# EAGLE schematic usbDirectController2 (EAGLE 9.4.0)

## Sheet 1 of 2
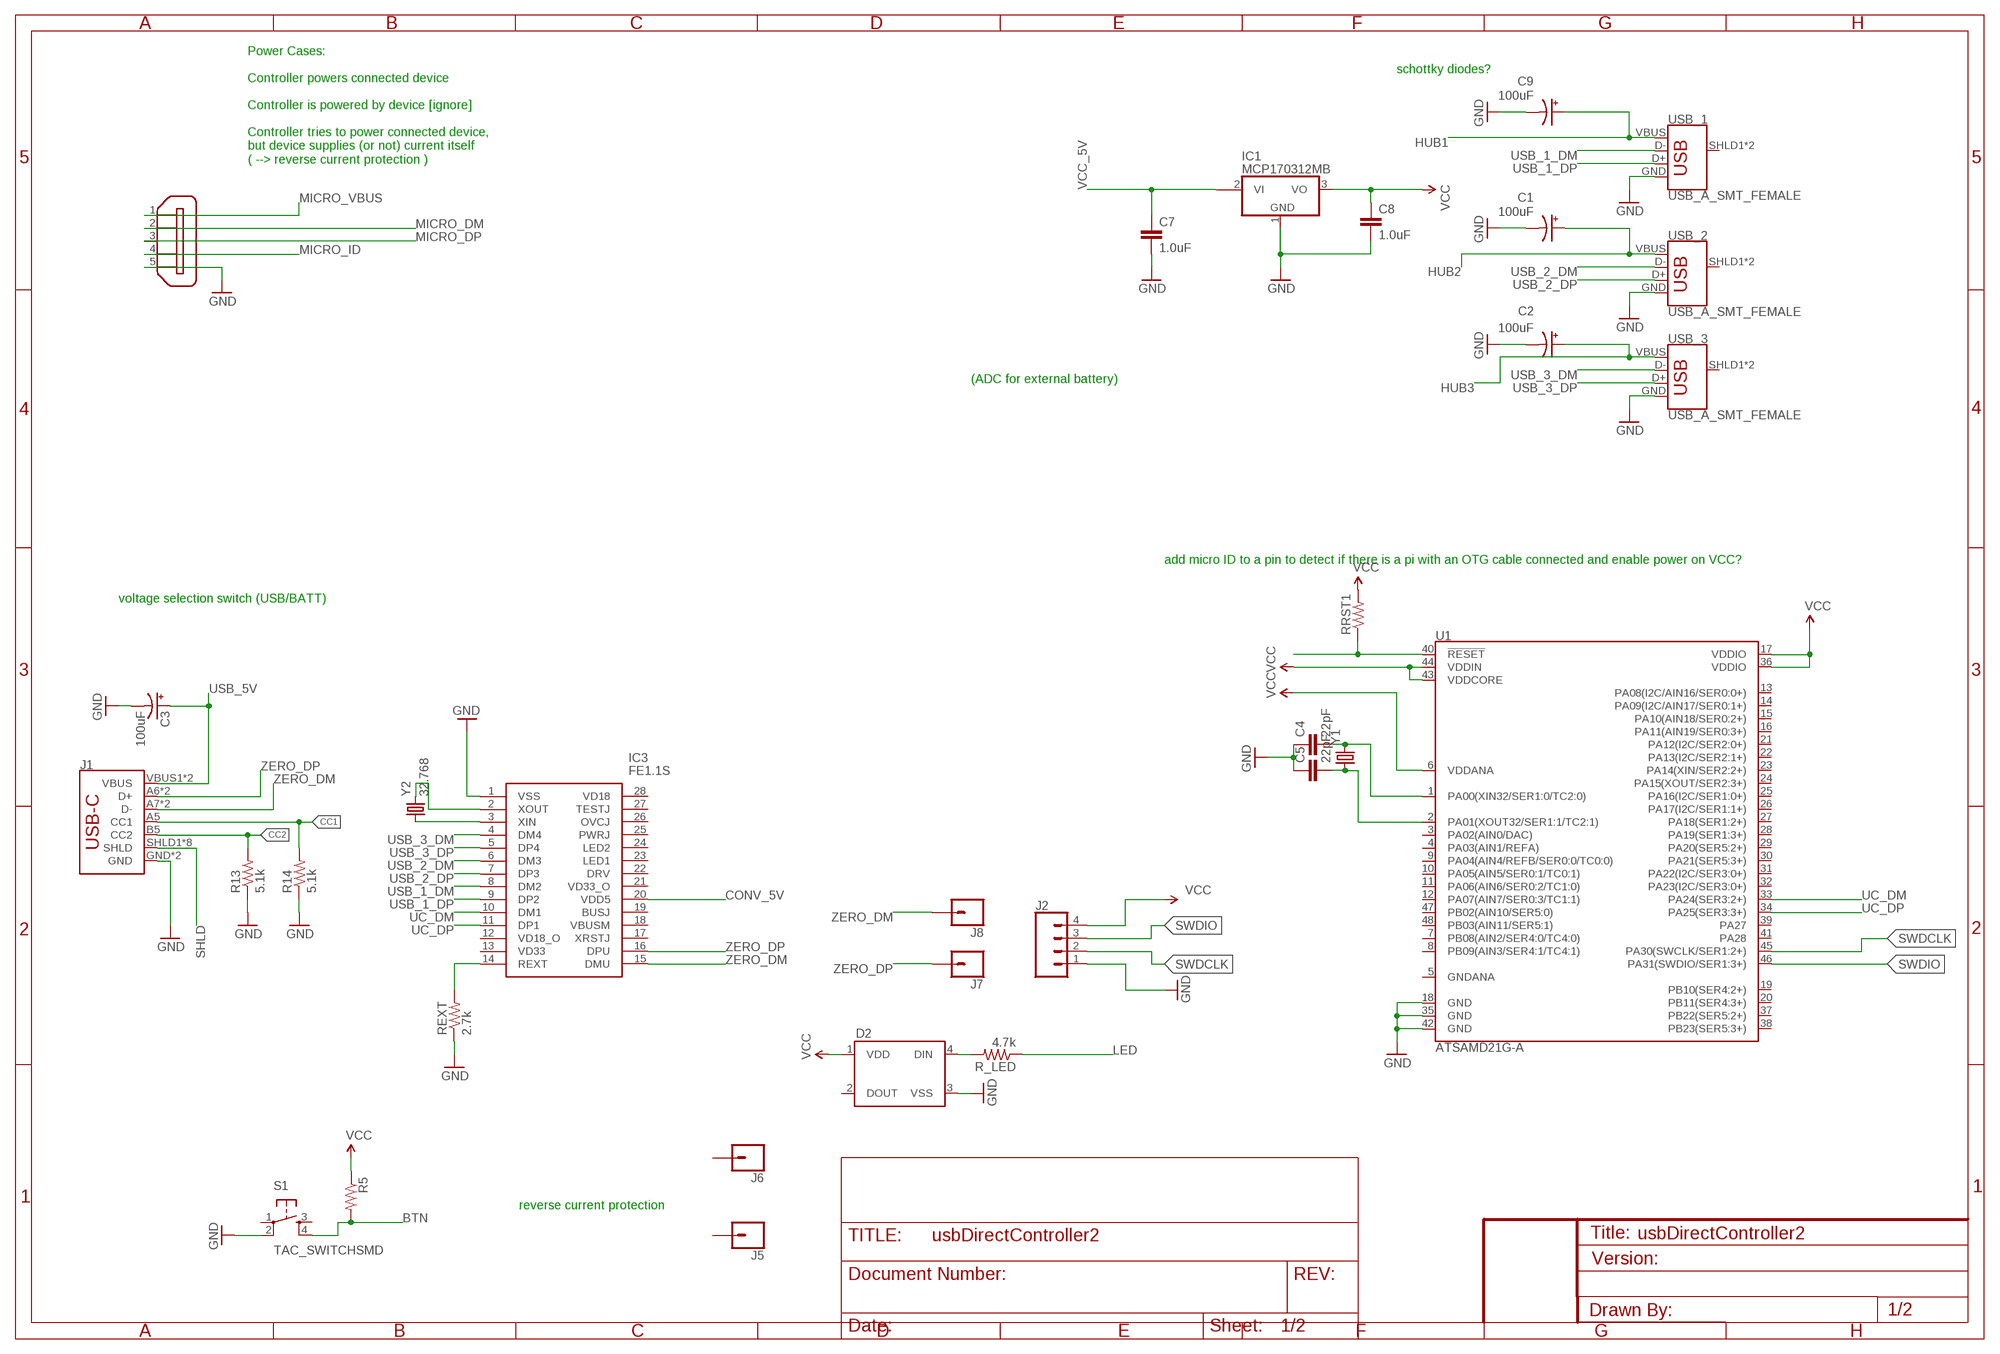
[diagram p0: schematic, sheet 1]

### Parts
C1  100uF  100UF-POLAR-25V-20%(ELEC)  [PANASONIC_D]
C2  100uF  100UF-POLAR-25V-20%(ELEC)  [PANASONIC_D]
C3  100uF  100UF-POLAR-25V-20%(ELEC)  [PANASONIC_D]
C4  22pF  CAP1206  [1206]
C5  22pF  CAP1206  [1206]
C7  1.0uF  1.0UF-1206-50V-10%  [1206]
C8  1.0uF  1.0UF-1206-50V-10%  [1206]
C9  100uF  100UF-POLAR-25V-20%(ELEC)  [PANASONIC_D]
D2  WS2812B  [WS2812B]
IC1  MCP170312MB  [SOT89]
IC3  FE1.1S  [SOP64P600X175-28N]
J1  USB_C16PIN  [USB-C-16P]
J2  CONN_04  [1X04]
J5  CONN_01POGOPIN_HOLE_0.58  [1X01_POGOPIN_HOLE_0.58_DIA]
J6  CONN_01POGOPIN_HOLE_0.58  [1X01_POGOPIN_HOLE_0.58_DIA]
J7  CONN_01POGOPIN_HOLE_0.58  [1X01_POGOPIN_HOLE_0.58_DIA]
J8  CONN_01POGOPIN_HOLE_0.58  [1X01_POGOPIN_HOLE_0.58_DIA]
R5  RESISTOR1206  [1206]
R13  5.1k  RESISTOR0805-RES  [0805]
R14  5.1k  RESISTOR0805-RES  [0805]
R_LED  4.7k  RESISTOR1206  [1206]
REXT  2.7k  RESISTOR1206  [1206]
RRST1  RESISTOR1206  [1206]
S1  TAC_SWITCHSMD  TAC_SWITCHPTH  [TACTILE-PTH]
U1  ATSAMD21G-A  [TQFP-48]
USB_1  USB_A_SMT_FEMALE  [USB-A-S-SILK-FEMALE]
USB_2  USB_A_SMT_FEMALE  [USB-A-S-SILK-FEMALE]
USB_3  USB_A_SMT_FEMALE  [USB-A-S-SILK-FEMALE]
X2  ZX62D-B-5PA8  [ZX62D-B-5PA8]
Y1  CRYSTALCRYSTAL-SMD-5X3-16MHZ  [CRYSTAL-SMD-5X3]
Y2  32.768  CRYSTALCRYSTAL-SMD-5X3-16MHZ  [CRYSTAL-SMD-5X3]

### Nets
BTN: R5.2 S1.4
CC1: J1.A5(CC1) R14.2
CC2: J1.B5(CC2) R13.2
CONV_5V [power]: IC3.20(VDD5)
GND: C1.- C2.- C3.- C4.1 C5.1 C7.2 C8.2 C9.- D2.3(VSS) IC1.1(GND) IC3.1(VSS) J1.GND J1.GND2(GND) J2.1 R13.1 R14.1 REXT.1 S1.2 U1.18(GND) U1.35(GND) U1.42(GND) USB_1.GND USB_2.GND USB_3.GND X2.5 ; also sheet 2
HUB1: C9.+ USB_1.VBUS
HUB2: C1.+ USB_2.VBUS
HUB3: C2.+ USB_3.VBUS
LED: R_LED.1
MICRO_DM: X2.2
MICRO_DP: X2.3
MICRO_ID: X2.4
MICRO_VBUS: X2.1
N$7: D2.4(DIN) R_LED.2
N$8: C4.2 U1.1(PA00(XIN32/SER1:0/TC2:0)) Y1.3
N$21: RRST1.1 U1.40(!RESET!)
N$23: IC3.3(XIN) Y2.1
N$24: IC3.2(XOUT) Y2.3
N$31: IC3.14(REXT) REXT.2
N$32: C5.2 U1.2(PA01(XOUT32/SER1:1/TC2:1)) Y1.1
SHLD: J1.SHLD1(SHLD) J1.SHLD2(SHLD) J1.SHLD3(SHLD) J1.SHLD4(SHLD) J1.SHLD5(SHLD) J1.SHLD6(SHLD) J1.SHLD7(SHLD) J1.SHLD8(SHLD)
SWDCLK: J2.2 U1.45(PA30(SWCLK/SER1:2+))
SWDIO: J2.3 U1.46(PA31(SWDIO/SER1:3+))
UC_DM: IC3.10(DM1) U1.33(PA24(SER3:2+))
UC_DP: IC3.11(DP1) U1.34(PA25(SER3:3+))
USB_1_DM: IC3.8(DM2) USB_1.D-
USB_1_DP: IC3.9(DP2) USB_1.D+
USB_2_DM: IC3.6(DM3) USB_2.D-
USB_2_DP: IC3.7(DP3) USB_2.D+
USB_3_DM: IC3.4(DM4) USB_3.D-
USB_3_DP: IC3.5(DP4) USB_3.D+
USB_5V: C3.+ J1.VBUS1(VBUS) J1.VBUS2(VBUS)
VCC [power]: C8.1 D2.1(VDD) IC1.3(VO) J2.4 R5.1 RRST1.2 U1.6(VDDANA) U1.17(VDDIO) U1.36(VDDIO) U1.43(VDDCORE) U1.44(VDDIN)
VCC_5V [power]: C7.1 IC1.2@1(VI1) ; also sheet 2
ZERO_DM: IC3.15(DMU) J1.A7(D-) J1.B7(D-) J8.1
ZERO_DP: IC3.16(DPU) J1.A6(D+) J1.B6(D+) J7.1
Unconnected: D2.2(DOUT) IC1.2(VI) IC3.12(VD18_O) IC3.13(VD33) IC3.17(XRSTJ) IC3.18(VBUSM) IC3.19(BUSJ) IC3.21(VD33_O) IC3.22(DRV) IC3.23(LED1) IC3.24(LED2) IC3.25(PWRJ) IC3.26(OVCJ) IC3.27(TESTJ) IC3.28(VD18) J5.1 J6.1 S1.1 S1.3 U1.3(PA02(AIN0/DAC)) U1.4(PA03(AIN1/REFA)) U1.5(GNDANA) U1.7(PB08(AIN2/SER4:0/TC4:0)) U1.8(PB09(AIN3/SER4:1/TC4:1)) U1.9(PA04(AIN4/REFB/SER0:0/TC0:0)) U1.10(PA05(AIN5/SER0:1/TC0:1)) U1.11(PA06(AIN6/SER0:2/TC1:0)) U1.12(PA07(AIN7/SER0:3/TC1:1)) U1.13(PA08(I2C/AIN16/SER0:0+)) U1.14(PA09(I2C/AIN17/SER0:1+)) U1.15(PA10(AIN18/SER0:2+)) U1.16(PA11(AIN19/SER0:3+)) U1.19(PB10(SER4:2+)) U1.20(PB11(SER4:3+)) U1.21(PA12(I2C/SER2:0+)) U1.22(PA13(I2C/SER2:1+)) U1.23(PA14(XIN/SER2:2+)) U1.24(PA15(XOUT/SER2:3+)) U1.25(PA16(I2C/SER1:0+)) U1.26(PA17(I2C/SER1:1+)) U1.27(PA18(SER1:2+)) U1.28(PA19(SER1:3+)) U1.29(PA20(SER5:2+)) U1.30(PA21(SER5:3+)) U1.31(PA22(I2C/SER3:0+)) U1.32(PA23(I2C/SER3:0+)) U1.37(PB22(SER5:2+)) U1.38(PB23(SER5:3+)) U1.39(PA27) U1.41(PA28) U1.47(PB02(AIN10/SER5:0)) U1.48(PB03(AIN11/SER5:1)) USB_1.SHLD1(SHIELD) USB_1.SHLD2(SHIELD) USB_2.SHLD1(SHIELD) USB_2.SHLD2(SHIELD) USB_3.SHLD1(SHIELD) USB_3.SHLD2(SHIELD) X2.S1 X2.S2 X2.S3 X2.S4

### Notes on the sheet
- schottky diodes?
- Power Cases:
  
  Controller powers connected device
  
  Controller is powered by device [ignore]
  
  Controller tries to power connected device, 
  but device supplies (or not) current itself
  ( --> reverse current protection )
- (ADC for external battery)
- add micro ID to a pin to detect if there is a pi with an OTG cable connected and enable power on VCC?
- voltage selection switch (USB/BATT)
- reverse current protection

## Sheet 2 of 2
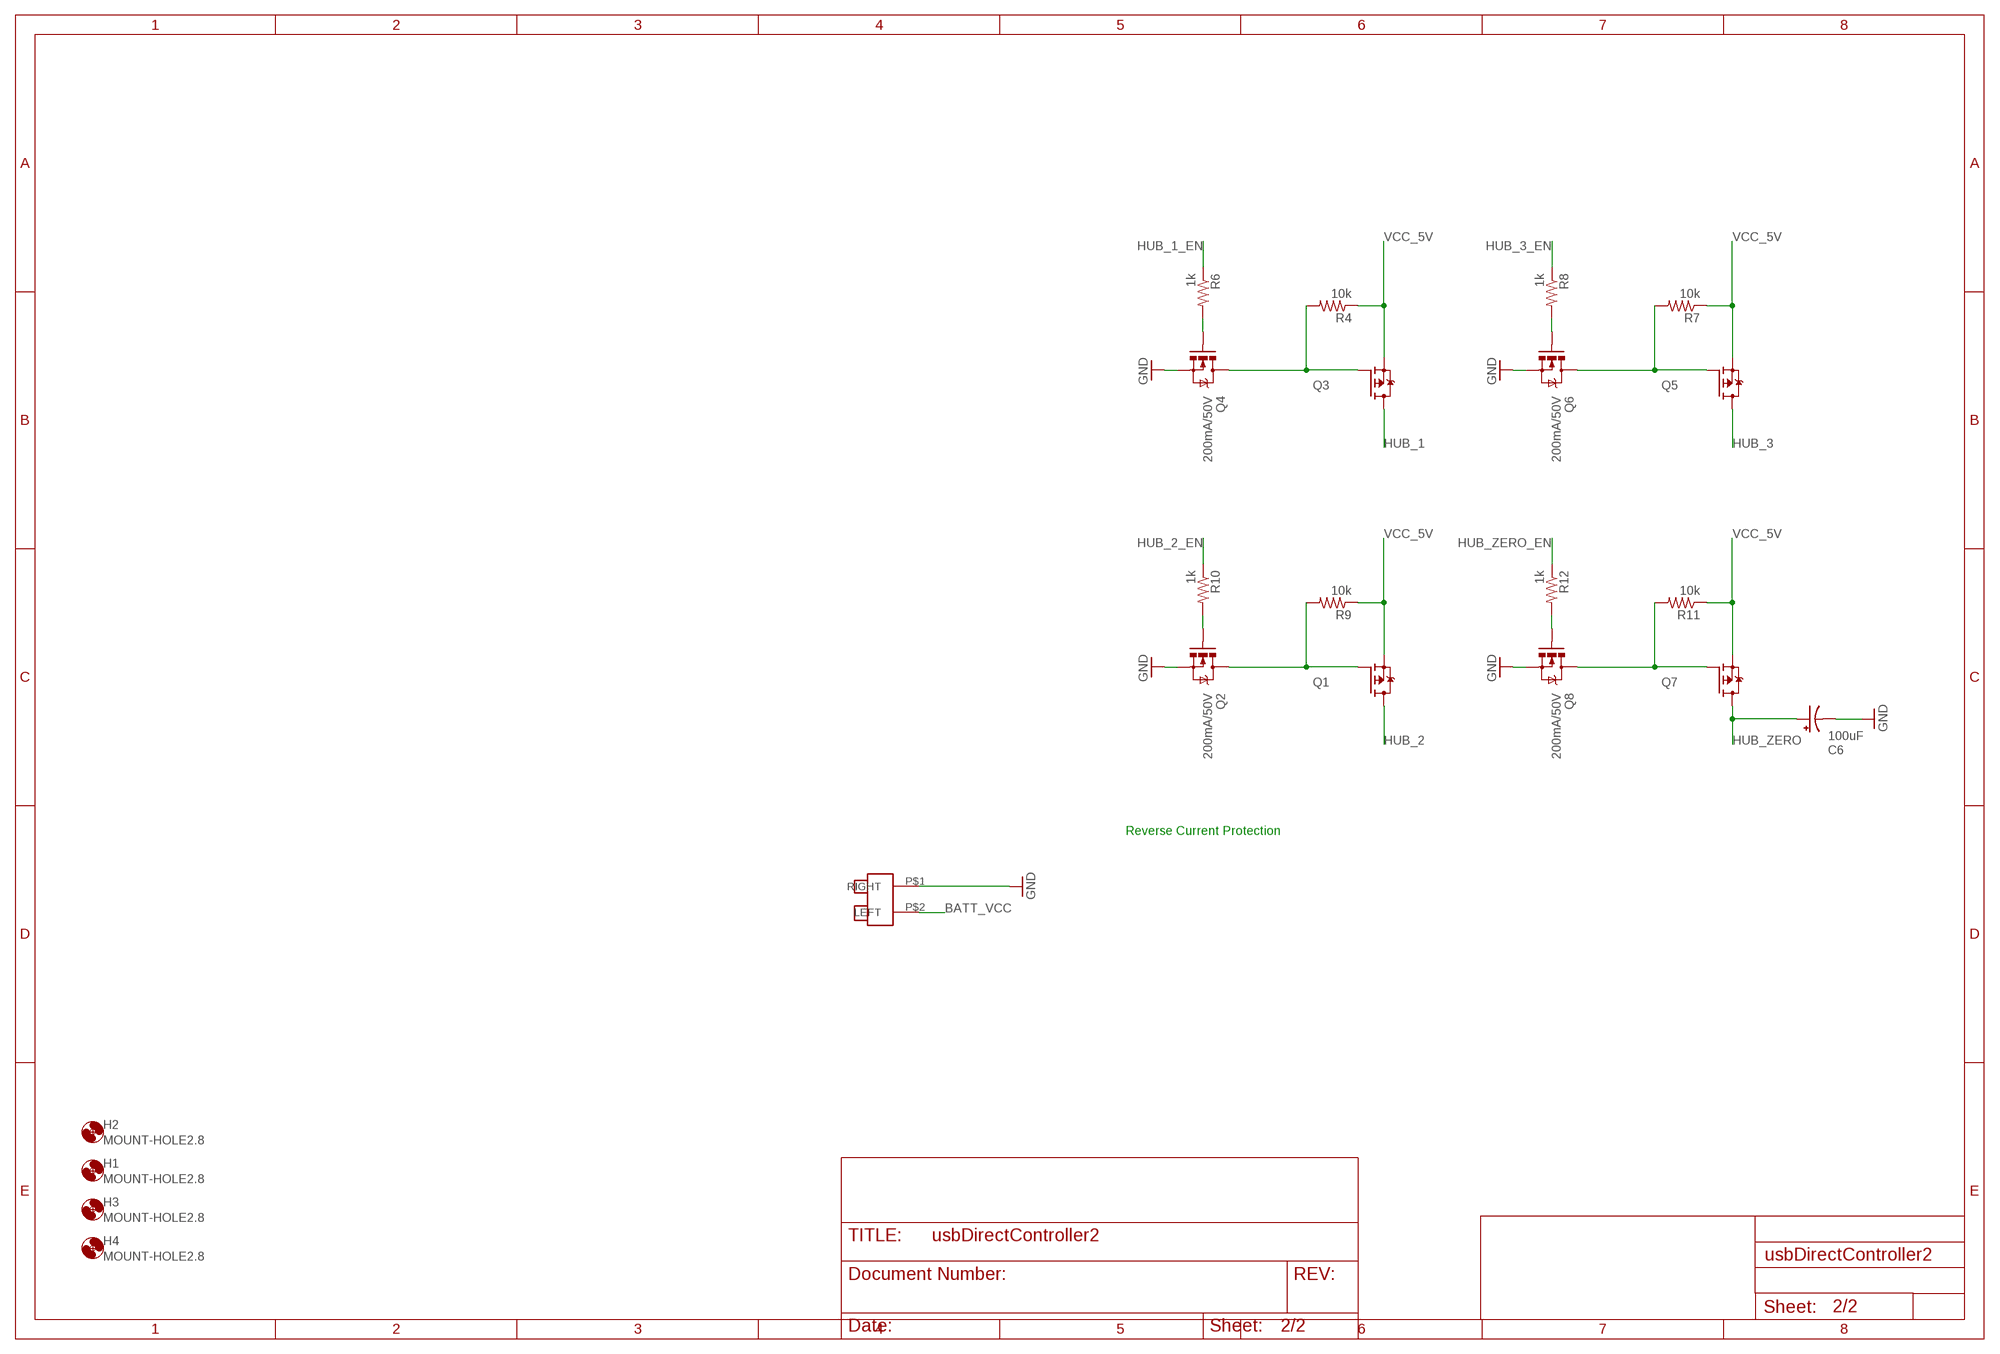
[diagram p1: schematic, sheet 2]

### Parts
C6  100uF  100UF-POLAR-25V-20%(ELEC)  [PANASONIC_D]
H1  MOUNT-HOLE2.8  [2,8]
H2  MOUNT-HOLE2.8  [2,8]
H3  MOUNT-HOLE2.8  [2,8]
H4  MOUNT-HOLE2.8  [2,8]
Q1  FDD4141TO252  [TO252]
Q2  200mA/50V  MOSFET-NCHANNELBSS138  [SOT23-3]
Q3  FDD4141TO252  [TO252]
Q4  200mA/50V  MOSFET-NCHANNELBSS138  [SOT23-3]
Q5  FDD4141TO252  [TO252]
Q6  200mA/50V  MOSFET-NCHANNELBSS138  [SOT23-3]
Q7  FDD4141TO252  [TO252]
Q8  200mA/50V  MOSFET-NCHANNELBSS138  [SOT23-3]
R4  10k  RESISTOR1206  [1206]
R6  1k  RESISTOR1206  [1206]
R7  10k  RESISTOR1206  [1206]
R8  1k  RESISTOR1206  [1206]
R9  10k  RESISTOR1206  [1206]
R10  1k  RESISTOR1206  [1206]
R11  10k  RESISTOR1206  [1206]
R12  1k  RESISTOR1206  [1206]
U$4  NANOFIT2  [NANOFIT2]

### Nets
BATT_VCC [hub_power]: U$4.P$2(LEFT)
GND: C6.- Q2.2(S) Q4.2(S) Q6.2(S) Q8.2(S) U$4.P$1(RIGHT) ; also sheet 1
HUB_1 [power]: Q3.3(D)
HUB_1_EN: R6.1
HUB_2 [hub_power]: Q1.3(D)
HUB_2_EN: R10.1
HUB_3 [power]: Q5.3(D)
HUB_3_EN: R8.1
HUB_ZERO [hub_power]: C6.+ Q7.3(D)
HUB_ZERO_EN: R12.1
N$1: Q1.1(G) Q2.3(D) R9.2
N$2: Q4.1(G) R6.2
N$3: Q3.1(G) Q4.3(D) R4.2
N$6: Q2.1(G) R10.2
N$12: Q5.1(G) Q6.3(D) R7.2
N$13: Q6.1(G) R8.2
N$15: Q7.1(G) Q8.3(D) R11.2
N$19: Q8.1(G) R12.2
VCC_5V [power]: Q1.2(S) Q3.2(S) Q5.2(S) Q7.2(S) R4.1 R7.1 R9.1 R11.1 ; also sheet 1

### Notes on the sheet
- Reverse Current Protection

## Library data of the parts
C1-C3 C6 C9 = SparkFun-Capacitors:100UF-POLAR: 100µF polarized capacitors A capacitor is a passive two-terminal electrical component used to store electrical energy temporarily in an electric field.; PROD_ID: CAP-12547
C4 C5 = SparkFun-Passives:CAP: Capacitor Standard 0603 ceramic capacitor, and 0.1" leaded capacitor.
C7 C8 = SparkFun-Capacitors:1.0UF: 1µF ceramic capacitors A capacitor is a passive two-terminal electrical component used to store electrical energy temporarily in an electric field.; PROD_ID: CAP-09822
D2 = SparkFun-LED:WS2812B: WS2812B - Intelligent control LED integrated light source Technical Specifications: Power Supply Voltage (VDD): 3.5 to 5.3 V Input Voltage (VI): -0.5 to VDD+0.5 V Operating Junction Temperature (Topt): -25°C to +80°C Storage Temperature Range (Tstg): -55°C to +150°C; PROD_ID: DIO-12503
H1-H4 = holes:MOUNT-HOLE: MOUNTING HOLE with drill center marker
IC1 = linear:MCP1703*: 250 mA, 16V, Low Quiescent Current LDO Regulator Source: http://ww1.microchip.com/downloads/en/DeviceDoc/22049b.pdf
IC3 = FE1.1S:FE1.1S: USB 2.0 HIGH SPEED 4-PORT HUB CONTROLLER Source: Datasheet <https://cdn-shop.adafruit.com/product-files/2991/FE1.1s Data Sheet (Rev. 1.0).pdf>; DESCRIPTION: USB 2.0 HIGH SPEED 4-PORT HUB CONTROLLER; HEIGHT: 1.75mm; MANUFACTURER_NAME: JFD IC; MANUFACTURER_PART_NUMBER: FE1.1S
J1 = SparkFun-Connectors:USB_C: USB Type C 16Pin Connector Super Speed pins not available on the 16-pin purely SMD connector so this part is best for USB 2.0 implementations. D1 and D2 are tied together enabling D+/- no matter which way the cable is plugged into the connector. The two channel configuration pins (CC1/2) are exposed. These are normally connected to ground via 5.1k resistors but can be reconfigured for high current/high power applications.; PROD_ID: CONN-14122
J2 = SparkFun-Connectors:CONN_04: Multi connection point. Often used as Generic Header-pin footprint for 0.1 inch spaced/style header connections On any of the 0.1 inch spaced packages, you can populate with these: Break Away Headers - Straight <https://www.sparkfun.com/products/116> (PRT-00116) Break Away Male Headers - Right Angle <https://www.sparkfun.com/products/553> (PRT-00553) Female Headers <https://www.sparkfun.com/products/115> (PRT-00115) Break Away Headers - Machine Pin <https://www.sparkfun.com/products/117> (PRT-00117) Break Away Female Headers - Swiss Machine Pin <https://www.sparkfun.com/products/743> (PRT-00743) For SCREWTERMINALS and SPRING TERMINALS visit here: Screw Terimnals on SparkFun.com <https://www.sparkfun.com/search/results?term=Screw+Terminals> (5mm/3.5mm/2.54mm spacing) This device is also useful as a general connection point to wire up your design to another part of your project. Our various solder wires solder well into these plated through hole pads. Hook-Up Wire - Assortment (Stranded, 22 AWG) <https://www.sparkfun.com/products/11375> (PRT-11375) Hook-Up Wire - Assortment (Solid Core, 22 AWG) <https://www.sparkfun.com/products/11367> (PRT-11367) View the entire wire category on our website here <https://www.sparkfun.com/categories/141> Special notes: Molex polarized connector foot print use with SKU : PRT-08231 with associated crimp pins and housings. 1MM SMD Version SKU: PRT-10208; PROD_ID: CONN-09696
J5-J8 = SparkFun-Connectors:CONN_01: Single connection point. Often used as Generic Header-pin footprint for 0.1 inch spaced/style header connections On any of the 0.1 inch spaced packages, you can populate with these: Break Away Headers - Straight <https://www.sparkfun.com/products/116> (PRT-00116) Break Away Male Headers - Right Angle <https://www.sparkfun.com/products/553> (PRT-00553) Female Headers <https://www.sparkfun.com/products/115> (PRT-00115) Break Away Headers - Machine Pin <https://www.sparkfun.com/products/117> (PRT-00117) Break Away Female Headers - Swiss Machine Pin <https://www.sparkfun.com/products/743> (PRT-00743) This device is also useful as a general connection point to wire up your design to another part of your project. Our various solder wires solder well into these plated through hole pads. Hook-Up Wire - Assortment (Stranded, 22 AWG) <https://www.sparkfun.com/products/11375> (PRT-11375) Hook-Up Wire - Assortment (Solid Core, 22 AWG) <https://www.sparkfun.com/products/11367> (PRT-11367) View the entire wire category on our website here <https://www.sparkfun.com/categories/141> Special notes: SMTSO-256-ET is a "flush mount" nut for a 4-40 screw. We mostly use this on specialty testbeds; it is a nice way to connect hardware to your PCB at an adjustable hieght. Also note, the SNAP packages are for using a snappable style connector. We sell a baggie of snaps and they are also used on two LilyPad designs: Snap Assortment - 30 pack (male and female) <https://www.sparkfun.com/products/11347> (DEV-11347) LilyPad Arduino SimpleSnap <https://www.sparkfun.com/products/10941> (DEV-10941) LilyPad SimpleSnap Protoboard <https://www.sparkfun.com/products/10940> (DEV-10940)
Q1 Q3 Q5 Q7 = transistor-fet:FDD4141: P-Channel PowerTrench® MOSFET Source: FDD4141.pdf
Q2 Q4 Q6 Q8 = SparkFun-DiscreteSemi:MOSFET-NCHANNEL: Common NMOSFET Parts MFG P/N Store ID Prod ID FDD8780 TRANS-09984 SI7820DN TRANS-11055 FDS6630A IC-08089 2N7002PW TRANS-11151 FQP30N06L COM-10213 TRANS-10060 BSS123LT1G TRANS-08345 BSS138 TRANS-00830 BS170 2N7000; PROD_ID: TRANS-00830
R4 R6-R12 R_LED = SparkFun-Resistors:RESISTOR: Resistor Basic schematic elements and footprints for 0603, 1206, and PTH resistors.
R5 R13 R14 REXT RRST1 = SparkFun-Passives:RESISTOR: Resistor Basic schematic elements and footprints for 0603, 1206, and PTH resistors.
S1 = SparkFun-Retired:TAC_SWITCH: Momentary Switch Button commonly used for reset or general input. Spark Fun Electronics SKU : COM-00097 SMT- SWCH-08247
U1 = SparkFun-IC-Microcontroller:ATSAMD21G: Atmel SAMD21G SMART ARM-Based Microcontroller The Atmel ® | SMART ™ SAM D21 is a series of low-power microcontrollers using the 32-bit ARM ® Cortex ® -M0+ processor, and ranging from 32- to 64-pins with up to 256KB Flash and 32KB of SRAM. The SAM D21 devices operate at a maximum frequency of 48MHz and reach 2.46 CoreMark/MHz. They are designed for simple and intuitive migration with identical peripheral modules, hex compatible code, identical linear address map and pin compatible migration paths between all devices in the product series. All devices include intelligent and flexible peripherals, Atmel Event System for inter-peripheral signaling, and support for capacitive touch button, slider and wheel user interfaces. Datasheet <https://cdn.sparkfun.com/datasheets/Dev/Arduino/Boards/Atmel-42181-SAM-D21_Datasheet.pdf> SparkFun Products SparkFun SAMD21 Mini Breakout <https://www.sparkfun.com/products/13664> (DEV-13664) SparkFun SAMD21 Dev Breakout <https://www.sparkfun.com/products/13672> (DEV-13672); PROD_ID: IC-13064
U$4 = volzolib:NANOFIT2
USB_1-USB_3 = SparkFun-Connectors:USB_A: USB-A Connector Male and female variants, as well as PTH and SMT variants SparkFun Products: SparkFun XBee Explorer Dongle <https://www.sparkfun.com/products/11697> PTH Male SparkFun MicroView-USB Programmer <https://www.sparkfun.com/products/12924> SMT Male SparkFun USB Type A Female Breakout <https://www.sparkfun.com/products/12700> SMT Female; PROD_ID: CONN-09520; SF_ID: PRT-09011
X2 = zx62d-b-5pa8-oshpark_10:ZX62D-B-5PA8: Micro USB Type B Connector - Standard, Shell Through Hole Source: http://www.hirose.co.jp/cataloge_hp/ed_ZX_20140804.pdf; MF: Hirose; MPN: ZX62D-B-5PA8; OC_FARNELL: 2300438; OC_NEWARK: 69W0712
Y1 Y2 = SparkFun-FreqCtrl:CRYSTAL: Various standard crystals. Proven footprints.; PROD_ID: XTAL-08218

## Net classes
0 default: width 0.254 mm, clearance 0.152 mm
1 power: width 0.381 mm, clearance 0.254 mm
2 hub_power: width 0.584 mm, clearance 0.254 mm
3 usbsignal: width 0.254 mm, clearance 0.203 mm